# Altium schematic sheet TopSheet_orig.SchDoc
size A
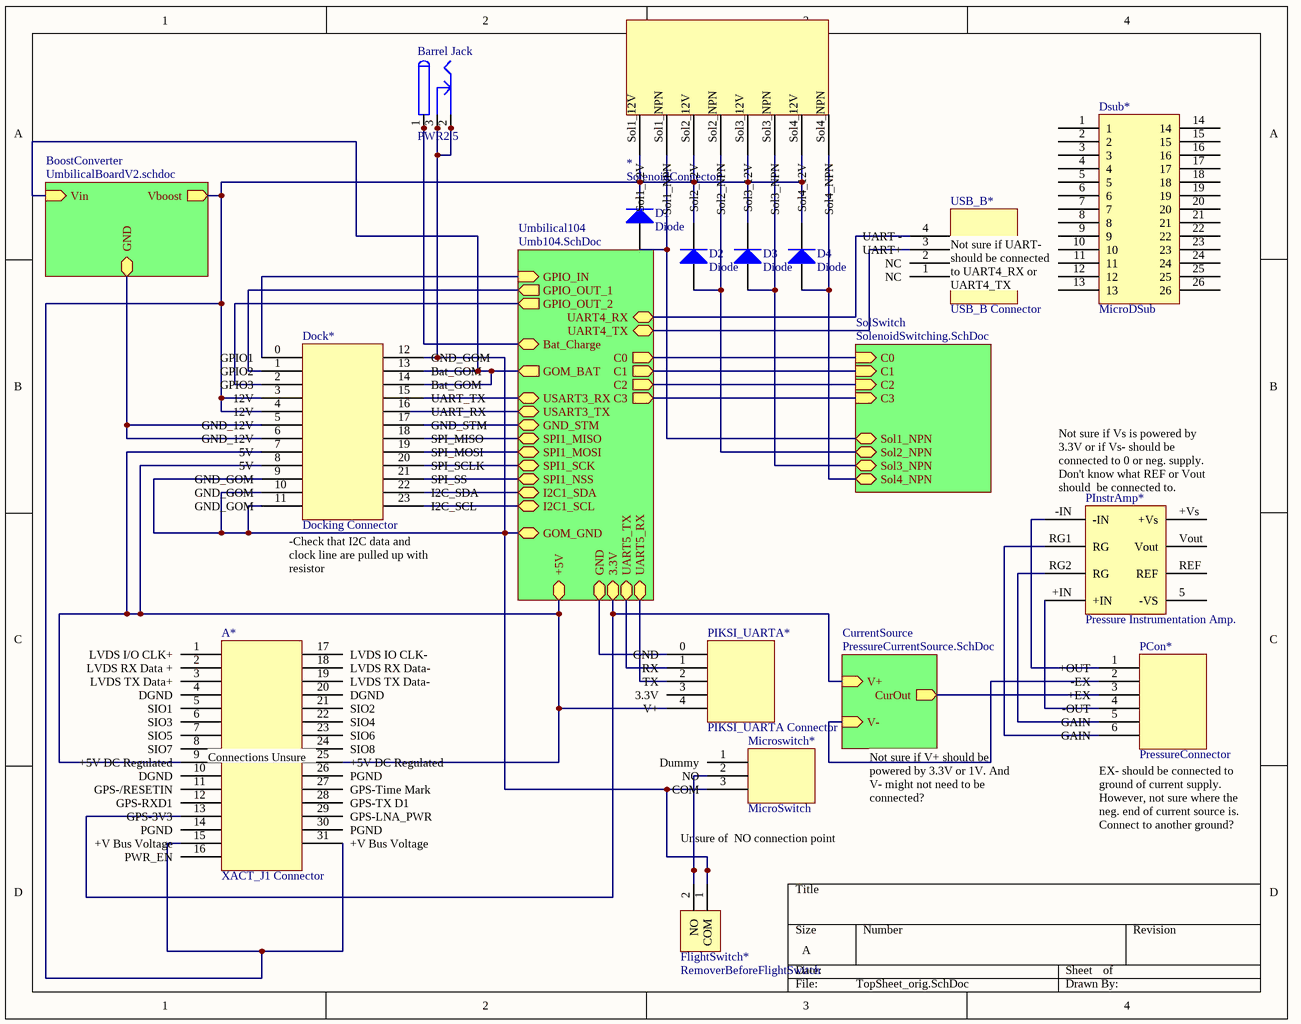
[diagram p0: TopSheet_orig.SchDoc]

## Parts
*  SolenoidConnector  [Solenoids 8Pin Right Angle]
A*  XACT_J1 Connector  [Airborn Nano]
Barrel_Jack  PWR2.5  [KLD-0202]
D1  Diode  [SMC]
D2  Diode  [SMC]
D3  Diode  [SMC]
D4  Diode  [SMC]
Dock*  Docking Connector  [Docking Connector]
Dsub*  MicroDSub  [MicroDSub]
FlightSwitch*  RemoverBeforeFlightSwitch  [RemoverBeforeFlight Switch]
Microswitch*  MicroSwitch  [MicroSwitch_3pin]
PCon*  PressureConnector  [Pressure Transducer]
PIKSI_UARTA*  PIKSI_UARTA Connector  [Molex Picoblade 5 Pin]
PInstrAmp*  Pressure Instrumentation Amp.  [Pressure Instrumentation Amp.]
USB_B*  USB_B Connector  [USB_B Connector]

## Sub-sheets
BoostConverter = UmbilicalBoardV2.schdoc: Vin (in), Vboost (out), GND (bidir)
CurrentSource = PressureCurrentSource.SchDoc: CurOut (out), V+ (in), V- (in)
SolSwitch = SolenoidSwitching.SchDoc: C1 (in), Sol3_NPN (bidir), C0 (in), C3 (in), Sol1_NPN (bidir), Sol2_NPN (bidir), Sol4_NPN (bidir), C2 (in)
Umbilical104 = Umb104.SchDoc: UART5_RX (bidir), C3 (out), UART4_RX (bidir), C2 (out), GOM_GND, SPI1_MISO (bidir), C1 (out), SPI1_NSS (bidir), GND (bidir), SPI1_SCK (bidir), UART5_TX (bidir), 3.3V (bidir), C0 (out), I2C1_SDA (bidir), I2C1_SCL (bidir), UART4_TX (bidir), SPI1_MOSI (bidir), +5V (bidir), GOM_BAT (out), GND_STM (bidir), Bat_Charge, GPIO_IN (in), GPIO_OUT_2 (out), GPIO_OUT_1 (out), USART3_TX (bidir), USART3_RX (bidir)

## Nets
NetBarrel_Jack_1: Barrel_Jack.1 Barrel_Jack.1A Barrel_Jack.1B ; sheet Umbilical104/Bat_Charge
NetBarrel_Jack_2: Barrel_Jack.2 Barrel_Jack.2A Barrel_Jack.2B Barrel_Jack.3 Barrel_Jack.3A Barrel_Jack.3B FlightSwitch*.1(COM) ; sheet Umbilical104/GOM_GND
NetD1_1: D1.1(A) ; sheet SolSwitch/Sol1_NPN
NetD1_2: D1.2(K) D2.2(K) D3.2(K) D4.2(K) ; sheet BoostConverter/Vboost
NetD2_1: D2.1(A) ; sheet SolSwitch/Sol2_NPN
NetD3_1: D3.1(A) ; sheet SolSwitch/Sol3_NPN
NetD4_1: D4.1(A) ; sheet SolSwitch/Sol4_NPN
(unnamed): sheet BoostConverter/Vin, sheet Umbilical104/GOM_BAT
(unnamed): sheet SolSwitch/C1, sheet Umbilical104/C1
(unnamed): sheet SolSwitch/C0, sheet Umbilical104/C0
(unnamed): sheet SolSwitch/C3, sheet Umbilical104/C3
(unnamed): sheet SolSwitch/C2, sheet Umbilical104/C2
(unnamed): sheet Umbilical104/3.3V, sheet CurrentSource/V+

Not connected (* = marked no-connect by the designer): * Sol1_12V Sol1_NPN Sol2_12V Sol2_NPN Sol3_12V Sol3_NPN Sol4_12V Sol4_NPN; A* 1(LVDS_I/O_CLK+) 2(LVDS_RX_Data_+) 3(LVDS_TX_Data+) 4(DGND) 5(SIO1) 6(SIO3) 7(SIO5) 8(SIO7) 9(+5V_DC_Regulated) 10(DGND) 11(GPS-/RESETIN) 12(GPS-RXD1) 13(GPS-3V3) 14(PGND) 15(+V_Bus_Voltage) 16(PWR_EN) 17(LVDS_IO_CLK-) 18(LVDS_RX_Data-) 19(LVDS_TX_Data-) 20(DGND) 21(SIO2) 22(SIO4) 23(SIO6) 24(SIO8) 25(+5V_DC_Regulated) 26(PGND) 27(GPS-Time_Mark) 28(GPS-TX_D1) 29(GPS-LNA_PWR) 30(PGND) 31(+V_Bus_Voltage); Dock* 0(GPIO1) 1(GPIO2) 2(GPIO3) 3(12V) 4(12V) 5(GND_12V) 6(GND_12V) 7(5V) 8(5V) 9(GND_GOM) 10(GND_GOM) 11(GND_GOM) 12(GND_GOM) 13(Bat_GOM) 14(Bat_GOM) 15(UART_TX) 16(UART_RX) 17(GND_STM) 18(SPI_MISO) 19(SPI_MOSI) 20(SPI_SCLK) 21(SPI_SS) 22(I2C_SDA) 23(I2C_SCL); Dsub* 1 2 3 4 5 6 7 8 9 10 11 12 13 14 15 16 17 18 19 20 21 22 23 24 25 26; FlightSwitch* 2(NO); Microswitch* 1(Dummy) 2(NO) 3(COM); PCon* 1(+OUT) 2(-EX) 3(+EX) 4(-OUT) 5(GAIN) 6(GAIN); PIKSI_UARTA* 0(GND) 1(RX) 2(TX) 3(3.3V) 4(V+); PInstrAmp* 5(-VS) +IN +Vs -IN REF RG1(RG) RG2(RG) Vout; USB_B* 1(NC) 2(NC) 3(UART+) 4(UART_-)

## Notes on the sheet
- Not sure if UART- should be connected to UART4_RX or UART4_TX
- (near PInstrAmp*) Not sure if Vs is powered by 3.3V or if Vs- should be connected to 0 or neg. supply.  Don't know what REF or Vout should  be connected to.
- (near Dock*) -Check that I2C data and clock line are pulled up with resistor
- (near A*) Connections Unsure
- Not sure if V+ should be powered by 3.3V or 1V. And V- might not need to be connected?
- (near PCon*) EX- should be connected to ground of current supply. However, not sure where the neg. end of current source is. Connect to another ground?
- Unsure of  NO connection point

## Library data of the parts
* = SolenoidConnector: Connector for 4 Solenoids
A* = XACT_J1 Connector: 31 Pin Airborn Nano Connector
Barrel_Jack = PWR2.5: Low Voltage Power Supply Connector; Published: 17-Dec-2003; DatasheetDocument: 09-May-2002; Publisher: Altium Limited; ComponentLink1Description: Manufacturer Link; ComponentLink1URL: http://domino.kycon.com/internet/Products.html
D1-D4 = Diode: Default Diode; Published: 8-Jun-2000; LatestRevisionDate: 17-Jul-2002; LatestRevisionNote: Re-released for DXP Platform.; PackageVersion: Sep-1996; PackageReference: SMC; Publisher: Altium Limited; PackageDescription: DO-214-AB/SMC; 2 C-Bend Leads; Body 7.9 x 5.9 mm, inc. leads (LxW); Code_JEDEC: DO-214-AB
Dock* = Docking Connector: 24 Pin Connector
Dsub* = MicroDSub: 12226-5150-00FR
FlightSwitch* = RemoverBeforeFlightSwitch: 53048-0210 Molex Picoblade
Microswitch* = MicroSwitch: Omron Electronics Inc-EMC Div D2FS-FL-N-A1
PCon* = PressureConnector: Molex 70553-0005
PIKSI_UARTA* = PIKSI_UART Connector: Molex Picoblade 5 Pin